# EAGLE design opl2msx (EAGLE 6.6.0)
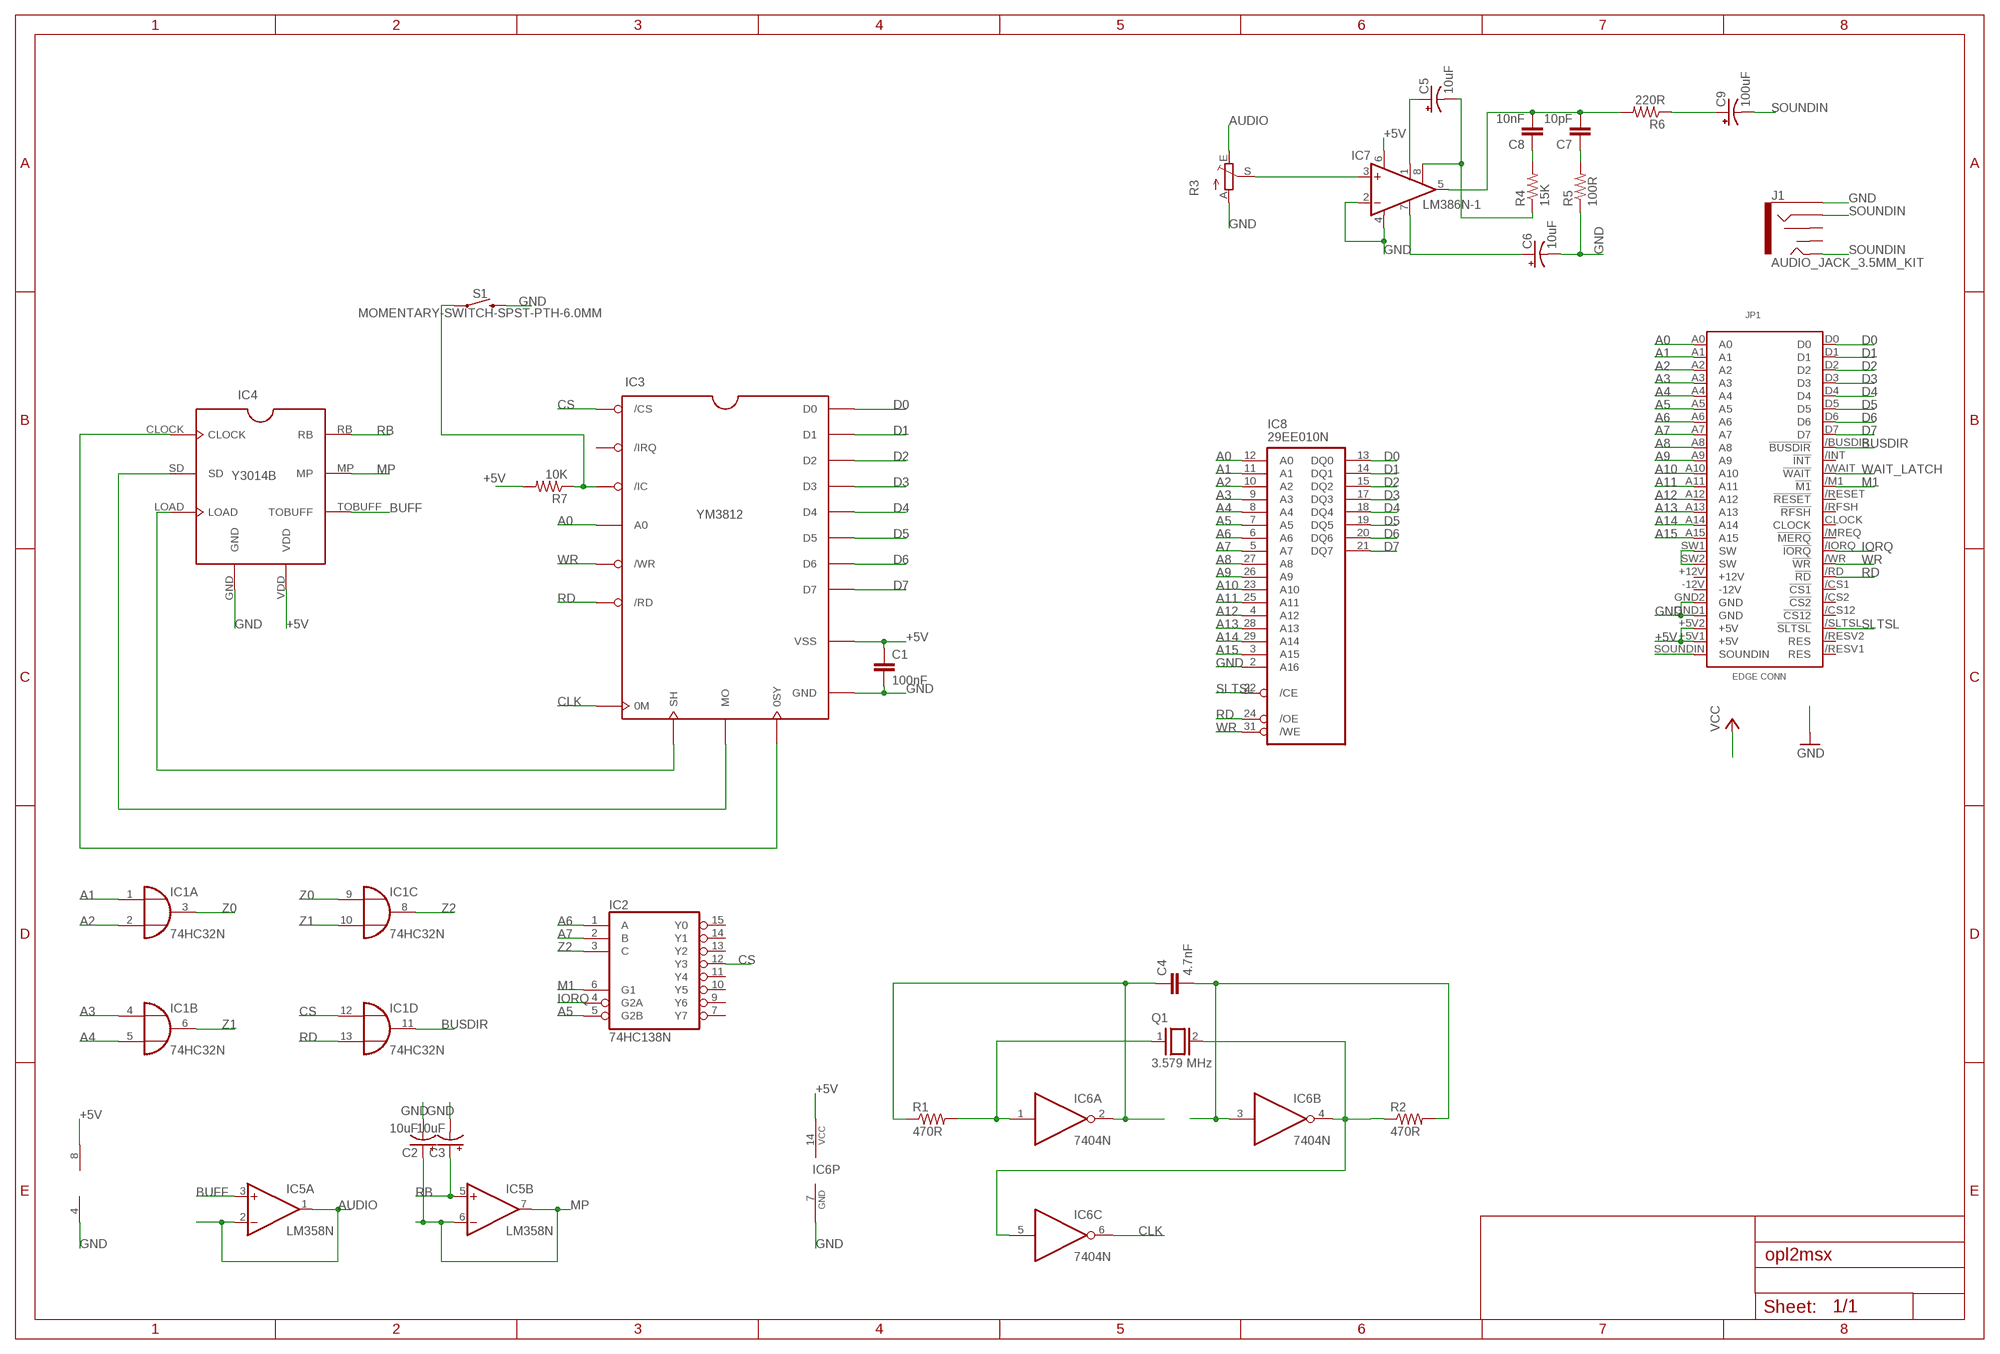
[diagram p0: schematic, sheet 1]

## Parts
C1  100nF  C-EU050-024X044  [C050-024X044]
C2  10uF  CPOL-USE2.5-6  [E2,5-6]
C3  10uF  CPOL-USE2.5-6  [E2,5-6]
C4  4.7nF  C-EU050-024X044  [C050-024X044]
C5  10uF  CPOL-USE2.5-6  [E2,5-6]
C6  10uF  CPOL-USE2.5-6  [E2,5-6]
C7  10pF  C-EU050-024X044  [C050-024X044]
C8  10nF  C-EU050-024X044  [C050-024X044]
C9  100uF  CPOL-USE2.5-6  [E2,5-6]
IC1  74HC32N  [DIL14]
IC2  74HC138N  [DIL16]
IC3  YM3812  YM3812-DIP24  [YM3812]
IC4  Y3014B  YM3014B-DIP8  [YM3014B]
IC5  LM358N  [DIL08]
IC6  7404N  [DIL14]
IC7  LM386N-1  [DIL08]
IC8  29EE010N  29XE010N  [DIL32-6]
J1  AUDIO_JACK_3.5MM_KIT  [AUDIO-JACK-KIT]
JP1  MSXCART  [PATOLA-MSX-SEEED]
Q1  3.579 MHz  XTAL/S  [QS]
R1  470R  R-US_0207/10  [0207/10]
R2  470R  R-US_0207/10  [0207/10]
R3  TRIM_EU-CA6V  [CA6V]
R4  15K  R-US_0207/10  [0207/10]
R5  100R  R-US_0207/10  [0207/10]
R6  220R  R-US_0207/10  [0207/10]
R7  10K  R-US_0207/10  [0207/10]
S1  MOMENTARY-SWITCH-SPST-PTH-6.0MM  [TACTILE_SWITCH_PTH_6.0MM]

## Nets
+5V: C1.1 IC3.VSS IC4.VDD IC5.8(P:V+) IC6.14(P:VCC) IC7.6(VS) JP1.+5V1(+5V) JP1.+5V2(+5V) R7.2 ; supply symbol labelled VCC
A0: IC3.A0 IC8.12(A0) JP1.A0
A1: IC1.1(A:I0) IC8.11(A1) JP1.A1
A2: IC1.2(A:I1) IC8.10(A2) JP1.A2
A3: IC1.4(B:I0) IC8.9(A3) JP1.A3
A4: IC1.5(B:I1) IC8.8(A4) JP1.A4
A5: IC2.5(G2B) IC8.7(A5) JP1.A5
A6: IC2.1(A) IC8.6(A6) JP1.A6
A7: IC2.2(B) IC8.5(A7) JP1.A7
A8: IC8.27(A8) JP1.A8
A9: IC8.26(A9) JP1.A9
A10: IC8.23(A10) JP1.A10
A11: IC8.25(A11) JP1.A11
A12: IC8.4(A12) JP1.A12
A13: IC8.28(A13) JP1.A13
A14: IC8.29(A14) JP1.A14
A15: IC8.3(A15) JP1.A15
AUDIO: IC5.1(A:OUT) IC5.2(A:-IN) R3.E
BUFF: IC4.TOBUFF IC5.3(A:+IN)
BUSDIR: IC1.11(D:O) JP1./BUSDIR(!BUSDIR)
CLK: IC3.0M IC6.6(C:O)
CS: IC1.12(D:I0) IC2.12(Y3) IC3./CS
D0: IC3.D0 IC8.13(DQ0) JP1.D0
D1: IC3.D1 IC8.14(DQ1) JP1.D1
D2: IC3.D2 IC8.15(DQ2) JP1.D2
D3: IC3.D3 IC8.17(DQ3) JP1.D3
D4: IC3.D4 IC8.18(DQ4) JP1.D4
D5: IC3.D5 IC8.19(DQ5) JP1.D5
D6: IC3.D6 IC8.20(DQ6) JP1.D6
D7: IC3.D7 IC8.21(DQ7) JP1.D7
GND: C1.2 C2.- C3.- C6.- IC3.GND IC4.GND IC5.4(P:V-) IC6.7(P:GND) IC7.2(-IN) IC7.4(GND) IC8.2(A16) J1.SLEEVE JP1.GND1(GND) JP1.GND2(GND) R3.A R5.1 S1.3
IORQ: IC2.4(G2A) JP1./IORQ(!IORQ)
M1: IC2.6(G1) JP1./M1(!M1)
MP: C2.+ IC4.MP IC5.6(B:-IN) IC5.7(B:OUT)
N$1: IC6.1(A:I) Q1.1 R1.2
N$2: C6.+ IC7.7(BYPASS)
N$3: IC6.4(B:O) IC6.5(C:I) Q1.2 R2.1
N$4: C4.2 IC6.3(B:I) R2.2
N$5: C5.+ IC7.1(GAIN)
N$6: IC7.3(+IN) R3.S
N$7: C4.1 IC6.2(A:O) R1.1
N$8: C5.- IC7.8(GAIN) R4.1
N$9: C7.2 C8.2 IC7.5(OUT) R6.2
N$10: C8.1 R4.2
N$11: C9.+ R6.1
N$12: C7.1 R5.2
N$13: IC3.SH IC4.LOAD
N$14: IC3.MO IC4.SD
N$15: IC3.0SY IC4.CLOCK
N$16: IC3./IC R7.1 S1.1
N$30: JP1.SW1(SW) JP1.SW2(SW)
RB: C3.+ IC4.RB IC5.5(B:+IN)
RD: IC1.13(D:I1) IC3./RD IC8.24(/OE) JP1./RD(!RD)
SLTSL: IC8.22(/CE) JP1./SLTSL(!SLTSL)
SOUNDIN: C9.- J1.RING J1.TIP JP1.SOUNDIN
WAIT_LATCH: JP1./WAIT(!WAIT)
WR: IC3./WR IC8.31(/WE) JP1./WR(!WR)
Z0: IC1.3(A:O) IC1.9(C:I0)
Z1: IC1.6(B:O) IC1.10(C:I1)
Z2: IC1.8(C:O) IC2.3(C)
Unconnected: IC2.7(Y7) IC2.9(Y6) IC2.10(Y5) IC2.11(Y4) IC2.13(Y2) IC2.14(Y1) IC2.15(Y0) IC3./IRQ IC6.8(D:O) IC6.9(D:I) IC6.10(E:O) IC6.11(E:I) IC6.12(F:O) IC6.13(F:I) IC8.1(NC) IC8.30(NC) J1.RSH J1.TSH JP1.+12V JP1.-12V JP1./CS1(!CS1) JP1./CS2(!CS2) JP1./CS12(!CS12) JP1./INT(!INT) JP1./MREQ(!MERQ) JP1./RESET(!RESET) JP1./RESV1(RES) JP1./RESV2(RES) JP1./RFSH(!RFSH) JP1.CLOCK

## Power pins joined to a net without a drawn wire
+5V: IC1.14(P:VCC) IC2.16(VCC) IC8.32(VCC)
GND: IC1.7(P:GND) IC2.8(GND) IC8.16(GND)

## Library data of the parts
C1 C4 C7 C8 = rcl:C-EU: CAPACITOR, European symbol
C2 C3 C5 C6 C9 = rcl:CPOL-US: POLARIZED CAPACITOR, American symbol
IC1 = 74xx-eu:74*32: Quad 2-input OR gate
IC2 = 74xx-eu:74*138: 3-line to 8-line DECODER/DEMULTIPLEXER
IC3 = YMSynth:YM3812: YM3812
IC4 = YMSynth:YM3014B: YM3014B
IC5 = linear:LM358: OP AMP also LM158; LM258; LM2904 Source: http://cache.national.com/ds/LM/LM158.pdf
IC6 = 74xx-us:74*04: Hex INVERTER
IC7 = linear:LM386?-*: Low Voltage Audio Power Amplifier Source: http://cache.national.com/ds/LM/LM386.pdf
IC8 = memories:29XE010
J1 = SparkFun-Connectors:AUDIO_JACK_3.5MM: Audio Jack 3.5mm variants of PTH and SMT stereo audio jack with bypass switches. SparkFun Products: SparkFun SparkPunk Sound Kit <[https://www.sparkfun.com/products/11177]> - PTH MP3 Trigger <https://www.sparkfun.com/products/13720> -3.5mm SMD SparkFun PicoBoard <https://www.sparkfun.com/products/11888>- 2.5mm SMD; PROD_ID: CONN-08774; SF_ID: PRT-08032
JP1 = msx-con-seeed:MSXCART
Q1 = special:XTAL/S: CRYSTAL
R1 R2 R4-R7 = resistor:R-US_: RESISTOR, American symbol
R3 = pot:TRIM_EU-: POTENTIOMETER
S1 = SparkFun-Switches:MOMENTARY-SWITCH-SPST: Momentary Switch (Pushbutton) - SPST Normally-open (NO) SPST momentary switches (buttons, pushbuttons). Variants PTH-12MM - 12mm square, through-hole Momentary Pushbutton Switch - 12mm Square <https://www.sparkfun.com/products/9190> (COM-09190) PTH-6.0MM, PTH-6.0MM-KIT - 6.0mm square, through-hole Mini Pushbutton Switch <https://www.sparkfun.com/products/97> (COM-00097) KIT package intended for soldering kit's - only one side of pads' copper is exposed. PTH-RIGHT-ANGLE-KIT - Right-angle, through-hole Right Angle Tactile Button <https://www.sparkfun.com/products/10791> - Used on SparkFun BigTime Watch Kit <https://www.sparkfun.com/products/11734> SMD-12MM - 12mm square, surface-mount Tactile Button - SMD (12mm) <https://www.sparkfun.com/products/12993> (COM-12993) Used on SparkFun PicoBoard <https://www.sparkfun.com/products/11888> SMD-4.5MM - 4.5mm Square Trackball Switch Used on SparkFun Blackberry Trackballer Breakout <https://www.sparkfun.com/products/13169> SMD-4.6MMX2.8MM - 4.60mm x 2.80mm, surface mount Used on SparkFun SAMD21 Mini Breakout <https://www.sparkfun.com/products/13664> SMD-5.2MM, SMD-5.2-REDUNDANT - 5.2mm square, surface-mount Mini Pushbutton Switch - SMD <https://www.sparkfun.com/products/8720> (COM-08720) Used on Arduino Pro Mini <https://www.sparkfun.com/products/11114> REDUNDANT package connects both switch circuits together SMD-6.0X3.5MM - 6.0 x 3.5mm, surface mount Momentary Reset Switch SMD <https://www.sparkfun.com/products/8229> (COM-08229) SMD-6.2MM-TALL - 6.2mm square, surface mount Tactile Button - SMD (6mm) <https://www.sparkfun.com/products/12992> Used on SparkFun Digital Sandbox <https://www.sparkfun.com/products/12651> SMD-RIGHT-ANGLE - Right-angle, surface mount Used on SparkFun Block for Intel® Edison - Arduino <https://www.sparkfun.com/products/13036>; PROD_ID: SWCH-08441; SF_SKU: COM-00097

## Board
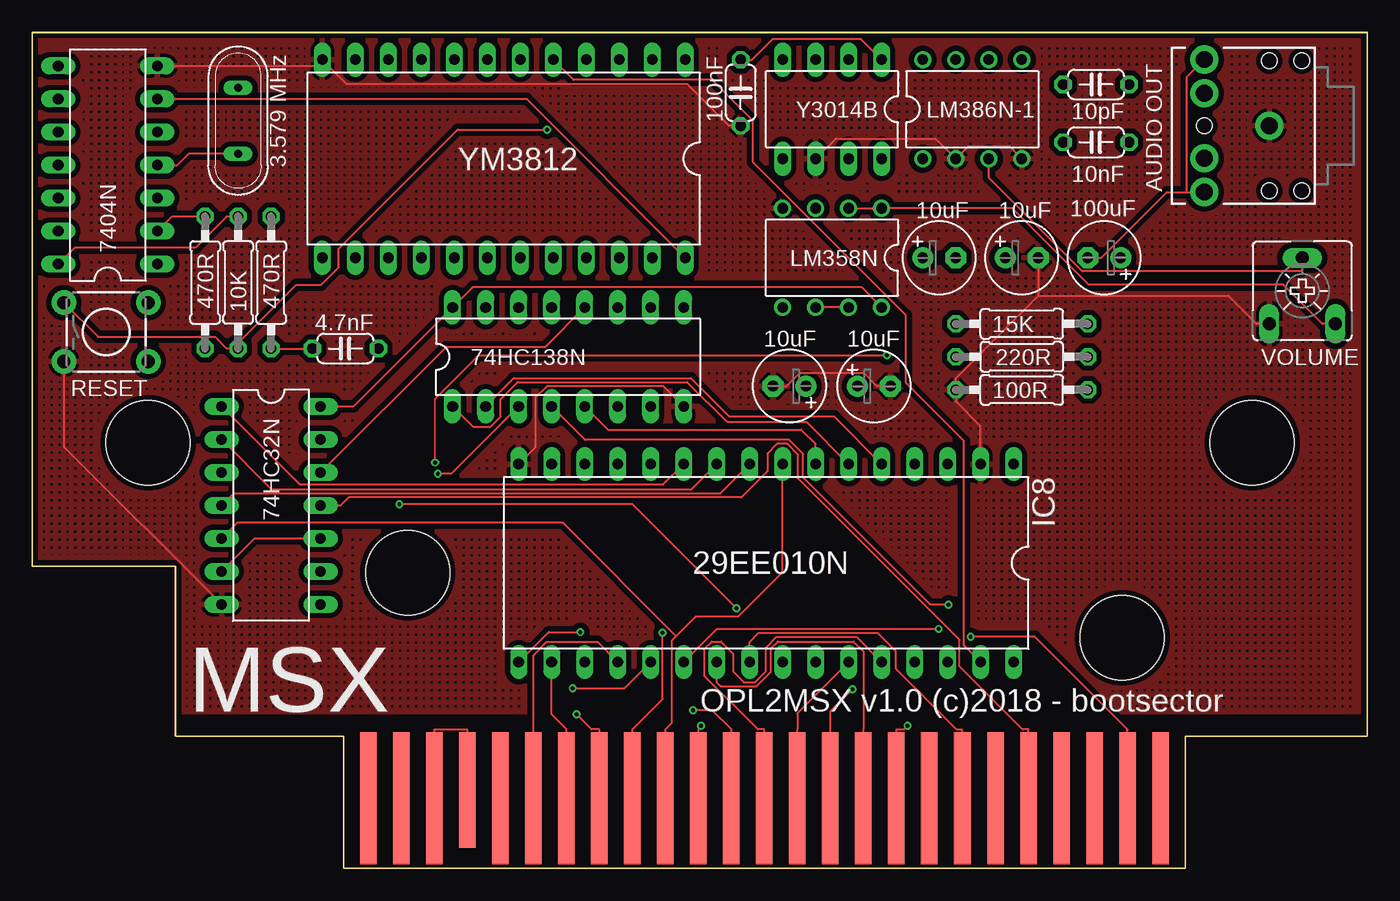
[diagram p1: board, top side]
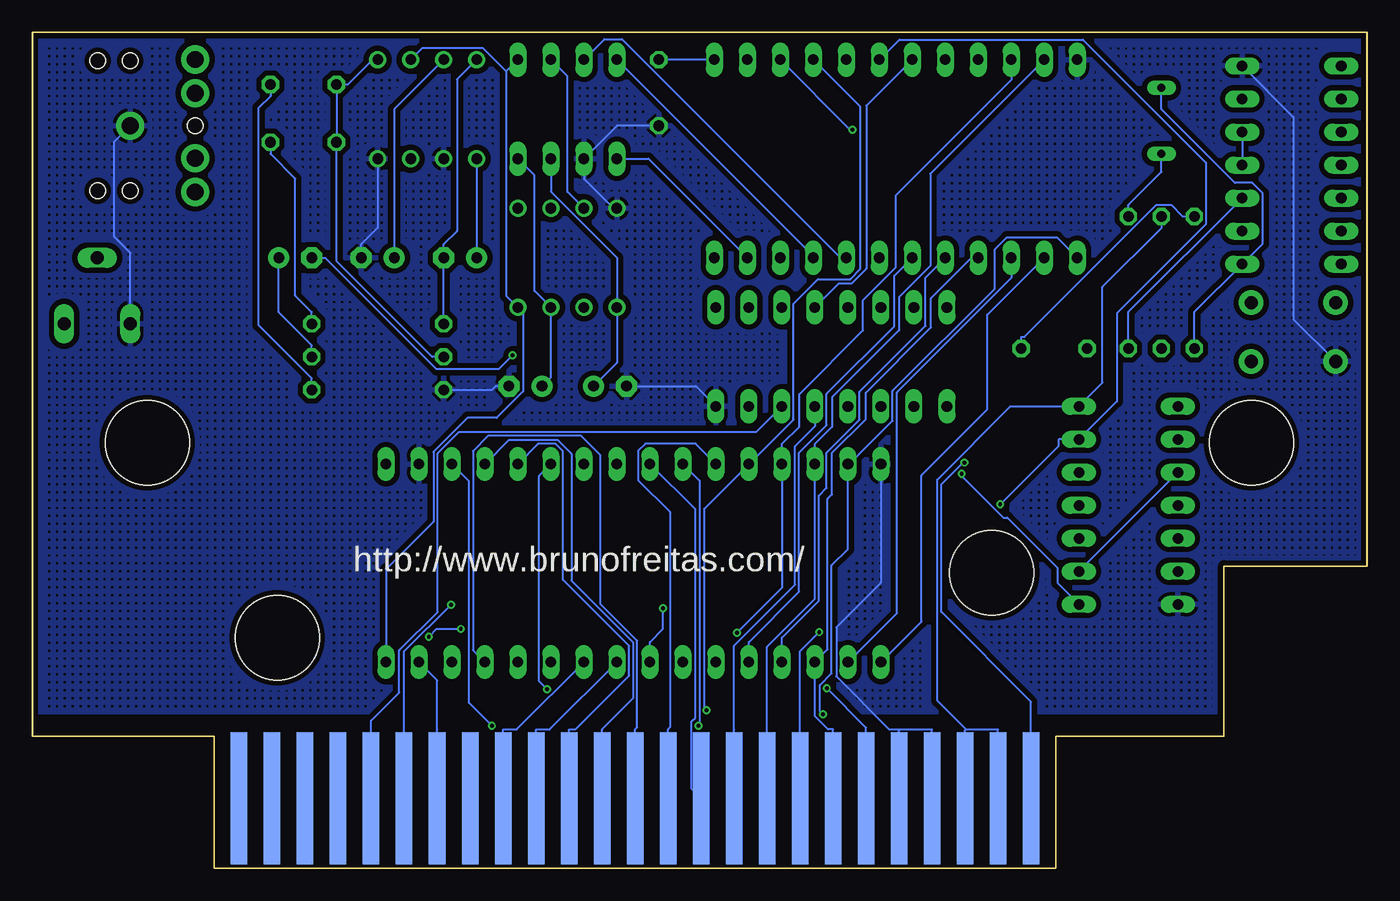
[diagram p2: board, bottom side, seen from below]

Size 102.72 x 64.33 mm. Coordinates in mm from the lower left corner, seen from the top.
Outline: 0,64.31 102.72,64.31 102.72,10.16 88.72,10.16 88.72,0 23.95,0 23.95,10.16 11,10.16 11,23.27 0,23.27 0,64.31
Copper layers (1*16): Top 0.035mm / dielectric 1.5mm / Bottom 0.035mm
Design rules "SeeedStudio_2layer_DRU_no_angle_20140221": minimum track width 6mil, minimum drill 12mil, track to track 6mil, track to pad 6mil, pad to pad 6mil, via to via 6mil, smd to smd 0mil, copper to edge 10mil, drill to drill 10mil, minimum pad ring 10mil, minimum via ring 6mil, stop-mask expansion 2mil, vias tented up to drill 100mil, thermal gap 10mil

### Footprints (pad centres in the part's own frame; a part is rotated, then mirrored left to right if it is on the bottom)
C050-024X044 = drill 0.813 octagon: 1 -2.54,0; 2 2.54,0
E2,5-6 = drill 0.813 pad 1.6: + -1.27,0 | drill 0.813 pad 1.6 octagon: - 1.27,0
DIL14 = drill 0.813 long: 1 -7.62,-3.81; 2 -5.08,-3.81; 3 -2.54,-3.81; 4 0,-3.81; 5 2.54,-3.81; 6 5.08,-3.81; 7 7.62,-3.81; 8 7.62,3.81; 9 5.08,3.81; 10 2.54,3.81; 11 0,3.81; 12 -2.54,3.81; 13 -5.08,3.81; 14 -7.62,3.81
DIL16 = drill 0.813 long: 1 -8.89,-3.81; 2 -6.35,-3.81; 3 -3.81,-3.81; 4 -1.27,-3.81; 5 1.27,-3.81; 6 3.81,-3.81; 7 6.35,-3.81; 8 8.89,-3.81; 9 8.89,3.81; 10 6.35,3.81; 11 3.81,3.81; 12 1.27,3.81; 13 -1.27,3.81; 14 -3.81,3.81; 15 -6.35,3.81; 16 -8.89,3.81
YM3812 = drill 0.813 long: 0M -13.97,7.62; 0SY -11.43,7.62; /CS 1.27,-7.62; /IC -8.89,-7.62; /IRQ -11.43,-7.62; /RD -1.27,-7.62; /WR -3.81,-7.62; A0 -6.35,-7.62; D0 8.89,-7.62; D1 11.43,-7.62; D2 13.97,7.62; D3 11.43,7.62; D4 8.89,7.62; D5 6.35,7.62; D6 3.81,7.62; D7 1.27,7.62; GND 13.97,-7.62; MO -6.35,7.62; NC8 3.81,-7.62; NC9 6.35,-7.62; NC19 -1.27,7.62; NC22 -8.89,7.62; SH -3.81,7.62; VSS -13.97,-7.62
YM3014B = drill 0.813 long: CLOCK 3.81,3.81; GND 1.27,3.81; LOAD 1.27,-3.81; MP -3.81,3.81; RB -1.27,3.81; SD 3.81,-3.81; TOBUFF -1.27,-3.81; VDD -3.81,-3.81
DIL08 = drill 0.813 pad 1.27: 1 -3.81,-3.81; 2 -1.27,-3.81; 3 1.27,-3.81; 4 3.81,-3.81; 5 3.81,3.81; 6 1.27,3.81; 7 -1.27,3.81; 8 -3.81,3.81
DIL32-6 = drill 0.813 long: 1 -19.05,-7.62; 2 -16.51,-7.62; 3 -13.97,-7.62; 4 -11.43,-7.62; 5 -8.89,-7.62; 6 -6.35,-7.62; 7 -3.81,-7.62; 8 -1.27,-7.62; 9 1.27,-7.62; 10 3.81,-7.62; 11 6.35,-7.62; 12 8.89,-7.62; 13 11.43,-7.62; 14 13.97,-7.62; 15 16.51,-7.62; 16 19.05,-7.62; 17 19.05,7.62; 18 16.51,7.62; 19 13.97,7.62; 20 11.43,7.62; 21 8.89,7.62; 22 6.35,7.62; 23 3.81,7.62; 24 1.27,7.62; 25 -1.27,7.62; 26 -3.81,7.62; 27 -6.35,7.62; 28 -8.89,7.62; 29 -11.43,7.62; 30 -13.97,7.62; 31 -16.51,7.62; 32 -19.05,7.62
AUDIO-JACK-KIT = drill 1.3 pad 2.184: RING 5,5.1; RSH 5,2.5; SLEEVE 0,0; TIP 5,-5.1; TSH 5,-2.5 | hole 1.2: 0,5; -2.5,5; -2.5,-5; 0,-5; 5,0
PATOLA-MSX-SEEED = smd 1.27 x 10.16 bottom: +5V1 -24.13,-35.242; +5V2 -21.59,-35.242; /CS1 34.29,-35.242; /CS12 31.75,-35.242; /IORQ 21.59,-35.242; /M1 24.13,-35.242; /RESET 16.51,-35.242; /RESV2 29.21,-35.242; /WAIT 26.67,-35.242; /WR 19.05,-35.242; A1 1.27,-35.242; A3 -1.27,-35.242; A5 -3.81,-35.242; A7 8.89,-35.242; A9 13.97,-35.242; A11 11.43,-35.242; A12 6.35,-35.242; A14 3.81,-35.242; D1 -6.35,-35.242; D3 -8.89,-35.242; D5 -11.43,-35.242; D7 -13.97,-35.242; GND1 -19.05,-35.242; GND2 -16.51,-35.242; SOUNDIN -26.67,-35.242 | smd 1.27 x 10.16: +12V -24.13,-35.242; -12V -26.67,-35.242; /BUSDIR 24.13,-35.242; /CS2 34.29,-35.242; /INT 26.67,-35.242; /MREQ 21.59,-35.242; /RD 19.05,-35.242; /RESV1 16.51,-35.242; /RFSH 29.21,-35.242; /SLTSL 31.75,-35.242; A0 1.27,-35.242; A2 -1.27,-35.242; A4 -3.81,-35.242; A6 8.89,-35.242; A8 6.35,-35.242; A10 11.43,-35.242; A13 3.81,-35.242; A15 13.97,-35.242; CLOCK -16.51,-35.242; D0 -6.35,-35.242; D2 -8.89,-35.242; D4 -11.43,-35.242; D6 -13.97,-35.242; SW2 -21.59,-35.242 | smd 1.27 x 8.89: SW1 -19.05,-34.608 | hole 6.5: 41.35,-7.89; -43.64,-7.89; -23.64,-17.89; 31.35,-22.89
QS = drill 0.61 long: 1 -2.54,0; 2 2.54,0
0207/10 = drill 0.813 octagon: 1 -5.08,0; 2 5.08,0
CA6V = drill 1.016 long: A -2.54,-2.54; E 2.54,-2.54; S 0,2.54
TACTILE_SWITCH_PTH_6.0MM = drill 1.016 pad 1.88: 1 -3.251,2.261; 2 3.251,2.261; 3 -3.251,-2.261; 4 3.251,-2.261

### Placement (x,y rotation side)
C1  54.51,59.69 270 top
C2  64.77,37.11 0 top
C3  58.27,37.11 180 top
C4  24.08,40.01 180 top
C5  69.8,46.99 0 top
C6  76.15,46.99 0 top
C7  81.87,60.33 180 top
C8  81.87,55.88 180 top
C9  82.5,46.99 180 top
IC1  18.37,27.94 270 top
IC2  41.23,39.37 0 top
IC3  36.27,54.61 180 top
IC4  61.55,58.42 180 top
IC5  61.55,46.99 180 top
IC6  5.79,54.13 90 top
IC7  72.34,58.42 0 top
IC8  56.47,23.5 180 top
J1  95.2,57.15 180 top
JP1  52.53,40.64 0 top
Q1  15.83,57.53 270 top
R1  13.29,45.09 270 top
R2  18.37,45.09 270 top
R3  97.74,44.45 0 top
R4  76.15,41.91 0 top
R5  76.15,36.83 0 top
R6  76.15,39.37 180 top
R7  15.83,45.09 90 top
S1  5.67,41.27 0 top

### Tracks (layer width: path | path; a pad name or v marks a point on that pad's centre or on a via)
+5V
  Top 0.152: C1.1 55.4,62.23 56.98,63.81 63.78,63.81 IC4.VDD | IC5.8 63.79,44.74 33.9,44.74 IC2.16 24.72,35.56 IC1.14 | R7.2 14.94,50.16 12.55,47.78 3.25,47.78 IC6.14
  Bottom 0.152: IC8.32 75.52,23.03 71.86,26.69 71.86,32.06 69.25,34.67 66.99,34.67 64.96,36.7 64.96,42.78 IC5.8 66.26,44.08 66.26,61.33 | IC4.VDD 66.26,61.33 | 66.26,61.33 68.05,63.12 72.72,63.12 IC7.6 | 30.86,10.71 28.4,10.71 JP1.+5V1 | 30.86,10.71 30.94,10.63 JP1.+5V2 | 30.86,10.71 33.08,12.92 33.08,29.92 27.44,35.56 IC1.14 20.36,37.38 20.36,44.74 15.83,49.28 R7.2 | IC3.VSS C1.1
A0  (via drill 0.3 pad 0.61)
  Top 0.152: v50.84,12.18 52.32,12.18 53.8,10.71 JP1.A0
  Bottom 0.152: IC3.A0 38.99,58.6 38.99,46.14 39.78,45.35 42.26,45.35 44.15,43.47 44.15,34.53 IC8.12 51.01,27.69 51.01,12.35 v50.84,12.18
A1
  Top 0.152: IC1.1 20.57,29.55 48.55,29.55 IC8.11
  Bottom 0.152: IC8.11 51.69,32.69 55.55,32.69 56.1,32.13 56.1,29.89 53.66,27.44 53.66,10.85 53.8,10.71 JP1.A1
A2  (via drill 0.3 pad 0.61)
  Top 0.152: v51.45,10.97 51.45,10.9 51.26,10.71 JP1.A2 | IC1.2 18.38,29.19 50.73,29.19 IC8.10
  Bottom 0.152: IC8.10 51.38,29.84 51.38,11.04 v51.45,10.97
A3
  Top 0.152: IC1.4 15.5,28.89 52.97,28.89 IC8.9
  Bottom 0.152: JP1.A3 51.98,6.12 51.98,11.33 51.71,11.6 51.71,27.63 IC8.9
A4
  Top 0.152: 49.54,17.87 51.06,19.39 54.33,19.39 57.74,22.8 IC8.8 | 49.54,17.87 49.23,17.56 49.23,11.21 48.72,10.71 JP1.A4 | 49.54,17.87 40.82,26.59 15.74,26.59 IC1.5
A5
  Top 0.152: IC8.7 60.28,32.66 59.17,33.77 44.28,33.77 IC2.5
  Bottom 0.152: JP1.A5 48.72,10.71 48.72,17.14 44.02,21.84 44.02,32.49 42.5,34.01 IC2.5
A6  (via drill 0.3 pad 0.61)
  Top 0.152: IC2.1 33.92,33.98 35.25,33.98 36.04,34.77 36.04,36.11 37.35,37.42 50.4,37.42 53.46,34.36 59.57,34.36 IC8.6 | JP1.A6 61.42,12.09 v63.12,13.79
  Bottom 0.152: v63.12,13.79 63.73,14.39 63.73,30.21 IC8.6
A7
  Top 0.152: IC2.2 37.04,37.73 50.67,37.73 53.62,34.78 61.69,34.78 IC8.5
  Bottom 0.152: JP1.A7 61.42,10.71 60.93,10.71 56.79,14.85 56.79,17.12 61.89,22.21 61.89,32.11 62.45,32.67 63.8,32.67 IC8.5
A8
  Top 0.152: JP1.A8 58.88,10.71 58.88,11.94 IC8.27
A9
  Bottom 0.152: JP1.A9 66.5,10.71 65.45,10.71 IC8.26
A10
  Top 0.152: IC8.23 52.66,14.32 52.96,14.02 55.73,14.02 56.84,15.13 56.84,16.94 57.36,17.46 63.2,17.46 63.96,16.7 63.96,10.71 JP1.A10
A11
  Bottom 0.152: JP1.A11 63.96,10.71 62.91,10.71 IC8.25
A12
  Bottom 0.152: IC8.4 66.04,32.97 62.32,32.97 61.24,31.89 61.24,22.15 56.49,17.4 56.49,13.1 58.88,10.71 JP1.A12
A13
  Top 0.152: JP1.A13 56.34,10.71 55.84,10.71 51.75,14.8 51.75,16.9 52.3,17.45 53,17.45 53.93,16.52 53.93,15.16 54.77,14.32 55.61,14.32 56.46,15.18 56.46,16.99 57.29,17.82 63.41,17.82 IC8.28
A14
  Bottom 0.152: IC8.29 68.82,16.8 68.82,32.11 67.66,33.28 60.5,33.28 59.01,31.79 59.01,20.35 56.18,17.52 56.18,10.86 56.34,10.71 JP1.A14
A15  (via drill 0.3 pad 0.61)
  Top 0.152: JP1.A15 66.5,10.71 67.1,10.71 v67.37,10.97
  Bottom 0.152: v67.37,10.97 69.12,12.73 69.12,29.8 IC8.3
AUDIO
  Top 0.152: R3.E 99.29,41.91 96.29,44.91 81.31,44.91 75.42,50.8 IC5.1 IC5.2
BUFF
  Bottom 0.152: IC5.3 61.55,52.07 61.55,60.96 IC4.TOBUFF
BUSDIR
  Top 0.152: 58.92,30.01 71.36,17.58 71.36,15.55 76.2,10.71 76.66,10.71 JP1./BUSDIR | 58.92,30.01 | 58.92,30.01 58.92,31.85 58.11,32.67 57.32,32.67 56.57,31.92 56.57,30.57 54.56,28.55 24.34,28.55 23.73,27.94 IC1.11
CLK
  Top 0.152: IC6.6 38.03,59.21 IC3.0M
CS
  Top 0.152: IC2.12 39.44,40.12 31.82,40.12 IC1.12
  Bottom 0.152: IC3./CS 38.53,58.7 38.53,46.16 39.7,45 40.68,45 IC2.12
D0  (via drill 0.3 pad 0.61)
  Top 0.152: v48.5,18.13 48.5,13.03 46.18,10.71 JP1.D0
  Bottom 0.152: v48.5,18.13 45.04,21.59 IC8.13 45.04,32.66 43.7,34 43.7,36.5 38.8,41.4 38.8,43.74 36.27,46.26 36.27,51.79 27.38,60.68 IC3.D0
D1
  Bottom 0.152: JP1.D1 46.18,17.06 42.5,20.74 IC8.14 42.5,32.66 41.18,33.98 41.18,36.25 36.03,41.4 36.03,43.95 33.61,46.37 33.61,53.47 IC3.D1
D2  (via drill 0.3 pad 0.61)
  Top 0.152: JP1.D2 43.64,10.71 43.02,10.71 v41.87,11.86
  Bottom 0.152: v41.87,11.86 42.12,12.11 42.12,14.11 41.21,15.01 41.21,23.31 39.96,24.57 IC8.15 39.86,31.11 36.53,34.45 36.53,36.75 28.65,44.62 28.65,47.64 27.74,48.56 23.87,48.56 IC3.D2
D3  (via drill 0.3 pad 0.61)
  Top 0.152: IC8.17 39.73,18.19 v42.17,18.19
  Bottom 0.152: IC8.17 34.3,19 34.3,30.26 29.22,35.33 29.22,42.61 IC3.D3 | JP1.D3 43.64,16.72 v42.17,18.19
D4
  Top 0.152: JP1.D4 41.1,10.71 39.96,11.85 IC8.18
  Bottom 0.152: IC8.18 36.18,19.65 36.18,36.64 | 36.18,36.64 | 36.18,36.64 27.38,45.44 IC3.D4
D5
  Bottom 0.152: IC3.D5 30.46,46.99 33.56,43.89 33.56,41.63 38.58,36.61 38.58,34.58 41.17,32 41.17,28.79 41.52,28.43 41.52,16.85 IC8.19 42.5,11.73 41.48,10.71 41.1,10.71 JP1.D5
D6
  Top 0.152: JP1.D6 38.56,16.41 39.58,17.43 43.48,17.43 IC8.20
  Bottom 0.152: IC8.20 45.04,17.77 42.19,20.61 42.19,28.7 41.61,29.28 41.61,31.99 39.07,34.53 39.07,36.66 33.99,41.74 33.99,45.47 IC3.D6
D7  (via drill 0.3 pad 0.61)
  Top 0.152: v41.59,13.87 45.57,13.87 IC8.21
  Bottom 0.152: IC3.D7 36.38,45.61 36.38,41.74 41.61,36.51 41.61,34.11 43.71,32.01 43.71,21.3 47.58,17.42 IC8.21 | JP1.D7 38.56,10.84 v41.59,13.87
GND
  Top 0.152: 77.42,44.07 71.07,37.72 R5.1 71.07,35.94 72.98,34.04 IC8.2 | C6.- 77.42,44.07 | 77.42,44.07 92.05,44.07 94.21,41.91 R3.A | IC4.GND 61.83,56.16 69.52,56.16 IC7.2 71.98,55.52 75.24,55.52 IC7.4 | C2.- 65.01,37.11 63.98,38.14 59.06,38.14 58.03,37.11 C3.- | C1.2 53.62,57.15 50.4,60.38 24.16,60.38 IC3.GND 21.82,61.75 IC6.7 | IC2.8 48.56,37.12 39.59,37.12 38.69,36.21 38.69,32.38 IC8.16 | S1.3 2.42,32.46 IC1.7
  Bottom 0.152: IC5.4 58.02,50.8 60.28,53.06 IC4.GND 57.74,57.15 C1.2 | C2.- 67.07,37.11 67.35,36.83 R5.1 | IC8.16 37.42,21.99 40.86,18.55 40.86,14.78 36.78,10.71 36.02,10.71 | C3.- 51.67,37.11 IC2.8 | R3.A 95.2,47.36 96.45,48.61 96.45,55.9 J1.SLEEVE | IC6.7 5.67,57.81 5.67,42.27 S1.3 | 36.02,10.71 33.48,10.71 JP1.GND1 | 36.02,10.71 36.02,10.63 JP1.GND2 | C6.- 77.42,48.02 76.15,49.29 IC7.4
  pour Top (isolate 0.406, hatched): -0.05,64.14 102.82,64.14 102.82,12.06 -0.05,12.06
  pour Bottom (isolate 0.406, hatched): -0.05,12.06 102.82,12.06 102.82,64.14 -0.05,64.14
IORQ  (via drill 0.3 pad 0.61)
  Top 0.152: v70.52,20.3 69.1,20.3 59.31,30.09 59.31,31.89 58.23,32.97 42.55,32.97 IC2.4
  Bottom 0.152: v70.52,20.3 74.12,16.7 74.12,10.71 JP1./IORQ
M1
  Bottom 0.152: JP1./M1 76.66,11.37 74.5,13.54 74.5,16.77 71.54,19.73 71.54,31.95 69.9,33.59 47.01,33.59 IC2.6
MP
  Top 0.152: IC5.7 IC5.6
  Bottom 0.152: IC4.MP 64.09,53.34 64.09,44.45 IC5.7 62.82,37.8 C2.+
N$1
  Bottom 0.152: Q1.1 15.83,58.42 10.16,52.75 8.83,52.75 8.03,51.95 8.03,48.08 IC6.1 13.29,42.82 R1.2
N$2
  Bottom 0.152: IC7.7 74.88,58.42 C6.+
N$3
  Top 0.152: IC6.4 11.15,54.13 12.02,54.99 Q1.2
  Bottom 0.152: R2.1 18.37,51.05 15.83,53.59 Q1.2 | IC6.5 IC6.4
N$4
  Top 0.152: R2.2 C4.2
  Bottom 0.152: R2.2 18.37,42.82 IC6.3
N$5
  Bottom 0.152: IC7.1 C5.+
N$6
  Top 0.152: R3.S 97.74,46 97.69,45.95 80.82,45.95 73.61,53.16 IC7.3
N$7
  Top 0.152: R1.1 10.72,50.16 IC6.2
  Bottom 0.152: R1.1 14.18,50.16 15.06,51.05 16.21,51.05 26.37,40.89 26.62,40.89 C4.1
N$8
  Bottom 0.152: IC7.8 70.04,60.72 70.04,49.05 71.07,48.02 C5.- R4.1
N$9
  Bottom 0.152: R6.2 71.96,39.37 79.33,46.74 C8.2 C7.2 78.44,60.33 76.53,62.23 IC7.5
N$10
  Bottom 0.152: C8.1 84.41,54.99 82.5,53.09 82.5,44.07 81.23,42.8 R4.2
N$11
  Bottom 0.152: R6.1 81.23,40.26 83.77,42.8 C9.+
N$12
  Bottom 0.152: C7.1 84.41,59.44 85.3,58.55 85.3,41.78 81.23,37.72 R5.2
N$13
  Bottom 0.152: IC4.LOAD 58.7,63.81 57.35,63.81 40.53,46.99 IC3.SH
N$14
  Bottom 0.152: IC4.SD 42.62,47.12 IC3.MO
N$15
  Bottom 0.152: IC4.CLOCK 55.32,54.61 IC3.0SY
N$16  (via drill 0.3 pad 0.61)
  Top 0.152: 15.38,40.01 20.28,44.91 22.21,44.91 23.57,46.27 23.57,47.69 32.74,56.85 v39.61,56.85 | 15.38,40.01 14.94,40.01 14.05,40.89 5.06,40.89 S1.1 | R7.1 15.38,40.01
  Bottom 0.152: v39.61,56.85 39.79,56.85 IC3./IC
N$30
  Top 0.152: JP1.SW1 33.48,10.71 30.94,10.71 JP1.SW2
RB
  Bottom 0.152: IC4.RB 62.82,52.08 57.74,47 IC5.5 57.74,38.91 C3.+
RD  (via drill 0.3 pad 0.61)
  Top 0.152: v54.19,20.02 46.19,28.02 v28.24,28.02 | IC8.24 55.2,17.42 55.9,18.12 65.05,18.12 66.43,16.75 66.43,15.41 71.13,10.71 71.58,10.71 JP1./RD
  Bottom 0.152: v54.19,20.02 54.19,18.43 55.2,17.42 IC8.24 | v28.24,28.02 23.73,32.53 23.73,33.02 IC1.13 19.26,35.94 19.26,42.72 12.4,49.58 12.4,54.31 21.87,63.78 35.99,63.78 IC3./RD
SLTSL  (via drill 0.3 pad 0.61)
  Top 0.152: IC8.22 52.67,18.43 v69.75,18.43 | v72.21,17.82 77.16,17.82 84.28,10.71 JP1./SLTSL
  Bottom 0.152: v72.21,17.82 71.61,18.43 v69.75,18.43
SOUNDIN  (via drill 0.3 pad 0.61)
  Top 0.152: v31,31.23 31,36.16 34.33,39.49 v65.77,39.49 | C9.- 82.26,46.99 87.32,52.05 88.87,52.05 | 88.87,52.05 J1.RING | 88.87,52.05 88.87,60.92 J1.TIP
  Bottom 0.152: JP1.SOUNDIN 25.86,12.83 32.77,19.74 32.77,29.56 31.09,31.23 v31,31.23 | C9.- 80.2,46.99 71.64,38.42 66.83,38.42 v65.77,39.49
WR
  Top 0.152: IC8.31 71.68,17.17 71.68,32.93 67.23,37.38 67.23,42.57 55.46,54.33 55.46,57.52 52.31,60.68 41.63,60.68 IC3./WR
  Bottom 0.152: JP1./WR 71.58,10.71 71.58,14.48 IC8.31
Z0
  Bottom 0.152: IC1.9 IC1.3
Z1
  Top 0.152: IC1.6 17.1,25.4 IC1.10
Z2  (via drill 0.3 pad 0.61)
  Top 0.152: IC2.3 32.23,30.37 v31.2,30.37
  Bottom 0.152: v31.2,30.37 31.2,30.2 27.99,26.99 27.69,26.99 23.83,23.13 23.83,21.97 IC1.8

### Text on the board
tPlace: AUDIO OUT | VOLUME | RESET | MSX | OPL2MSX v1.0 (c)2018 - bootsector
bPlace: http://www.brunofreitas.com/